# EAGLE design Plipbox (EAGLE 6.6.0)
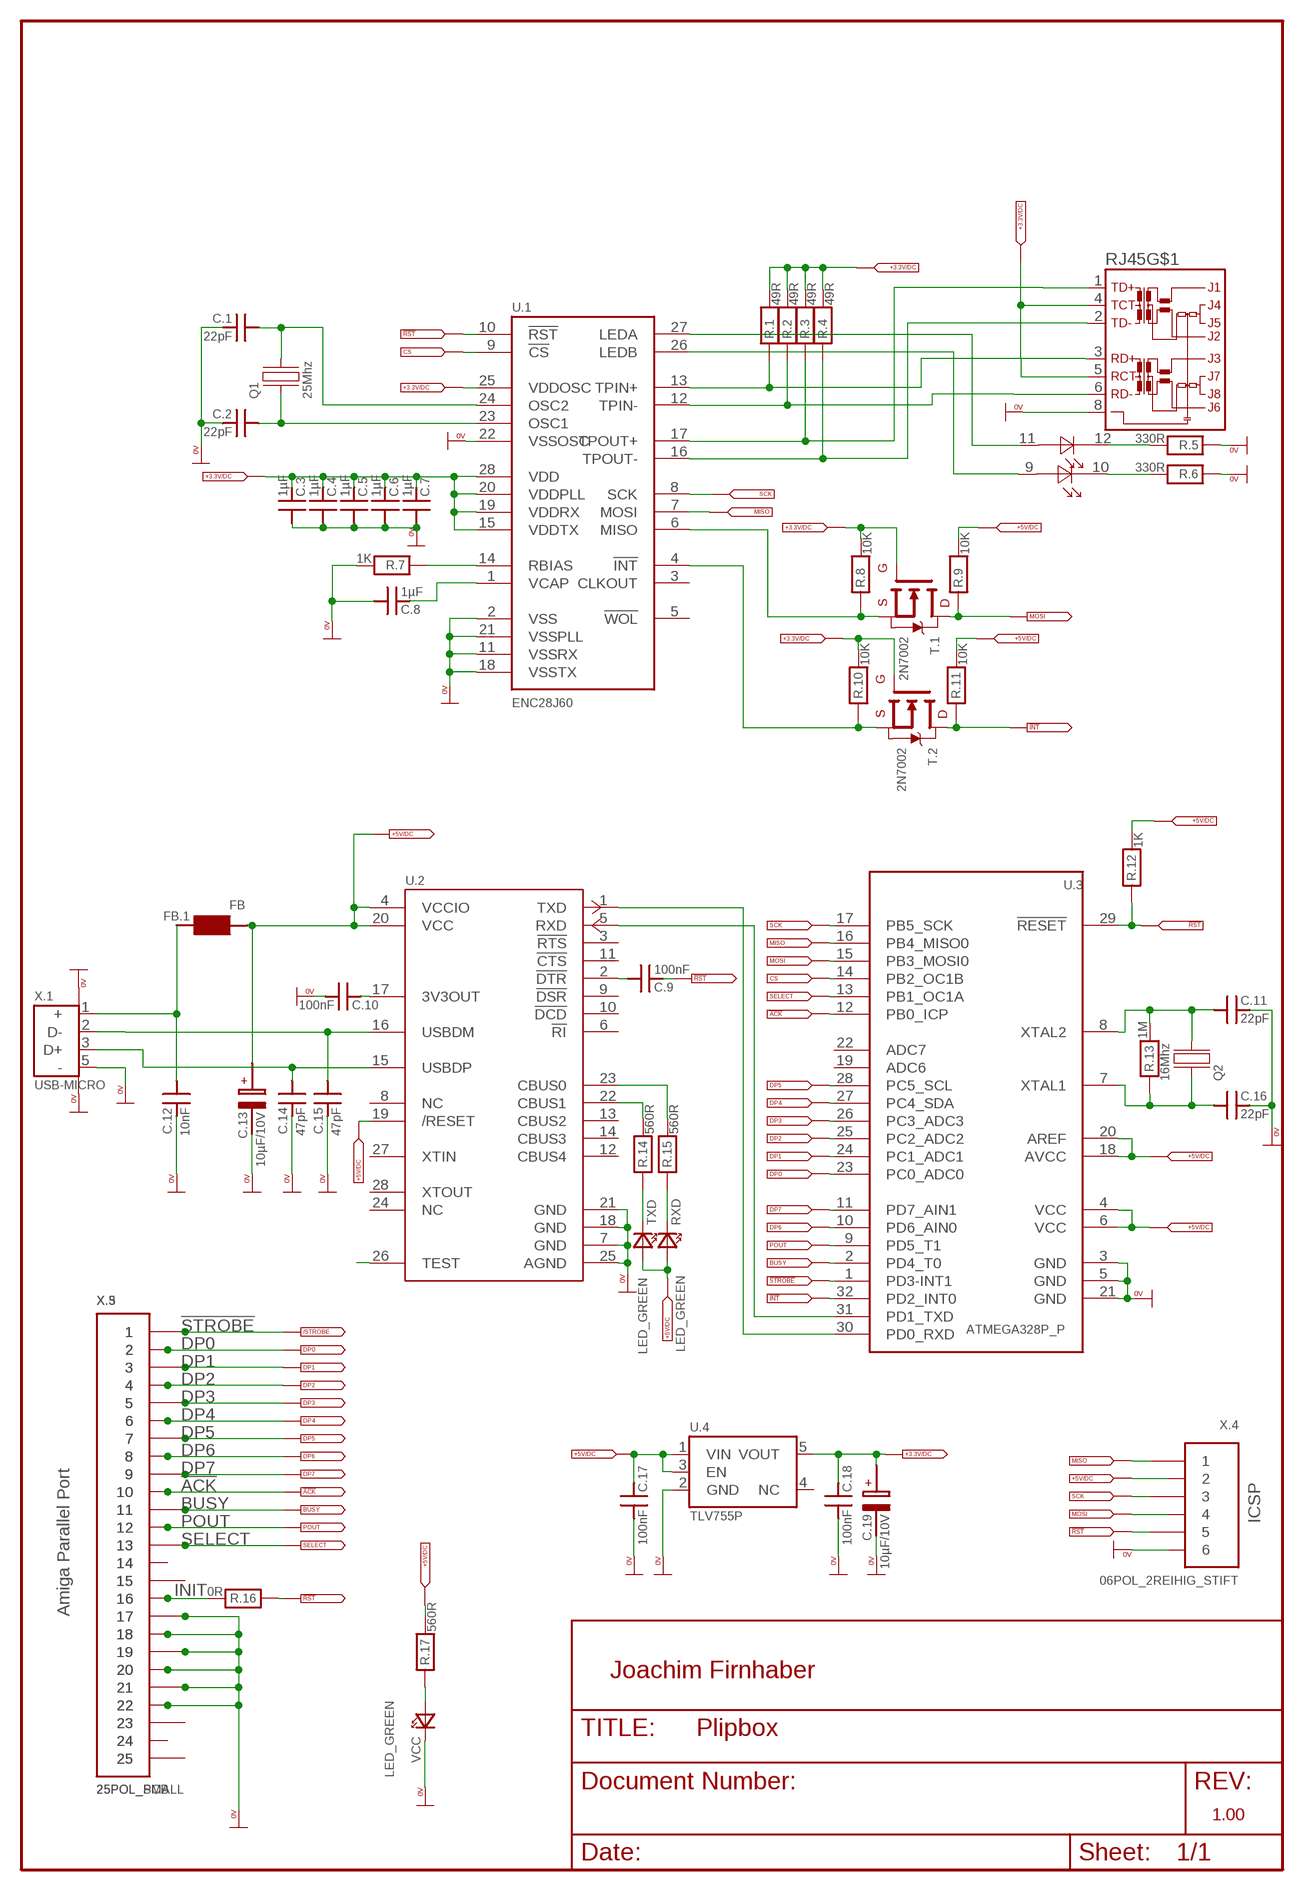
[diagram p0: schematic, sheet 1]

## Parts
C.1  22pF  CAPACITOR_SMD_0805  [0805]
C.2  22pF  CAPACITOR_SMD_0805  [0805]
C.3  1µF  CAPACITOR_SMD_0805  [0805]
C.4  1µF  CAPACITOR_SMD_0805  [0805]
C.5  1µF  CAPACITOR_SMD_0805  [0805]
C.6  1µF  CAPACITOR_SMD_0805  [0805]
C.7  1µF  CAPACITOR_SMD_0805  [0805]
C.8  1µF  CAPACITOR_SMD_0805  [0805]
C.9  100nF  CAPACITOR_SMD_0805  [0805]
C.10  100nF  CAPACITOR_SMD_0805  [0805]
C.11  22pF  CAPACITOR_SMD_0805  [0805]
C.12  10nF  CAPACITOR_SMD_0805  [0805]
C.13  10µF/10V  TANTAL_SMD_A(3216)  [3216]
C.14  47pF  CAPACITOR_SMD_0805  [0805]
C.15  47pF  CAPACITOR_SMD_0805  [0805]
C.16  22pF  CAPACITOR_SMD_0805  [0805]
C.17  100nF  CAPACITOR_SMD_0805  [0805]
C.18  100nF  CAPACITOR_SMD_0805  [0805]
C.19  10µF/10V  TANTAL_SMD_A(3216)  [3216]
FB.1  FB  FERRIT-BEAD  [0805]
Q1  25Mhz  QUARZ_3,4X2,7  [3,4X2,7X0,75]
Q2  16Mhz  QUARZ_3,4X2,7  [3,4X2,7X0,75]
R.1  49R  RESISTOR_SMD_0805  [0805]
R.2  49R  RESISTOR_SMD_0805  [0805]
R.3  49R  RESISTOR_SMD_0805  [0805]
R.4  49R  RESISTOR_SMD_0805  [0805]
R.5  330R  RESISTOR_SMD_0805  [0805]
R.6  330R  RESISTOR_SMD_0805  [0805]
R.7  1K  RESISTOR_SMD_0805  [0805]
R.8  10K  RESISTOR_SMD_0805  [0805]
R.9  10K  RESISTOR_SMD_0805  [0805]
R.10  10K  RESISTOR_SMD_0805  [0805]
R.11  10K  RESISTOR_SMD_0805  [0805]
R.12  1K  RESISTOR_SMD_0805  [0805]
R.13  1M  RESISTOR_SMD_0805  [0805]
R.14  560R  RESISTOR_SMD_0805  [0805]
R.15  560R  RESISTOR_SMD_0805  [0805]
R.16  0R  RESISTOR_SMD_0805  [0805]
R.17  560R  RESISTOR_SMD_0805  [0805]
RJ45  WE-RJ45_LAN_7499011222  [WE-RJ45_LAN_10/100_BASET_7499011222]
RXD  LED_GREEN  LED_0805  [0805]
T.1  2N7002  2N7002_N  [SOT23]
T.2  2N7002  2N7002_N  [SOT23]
TXD  LED_GREEN  LED_0805  [0805]
U.1  ENC28J60  EN28J60  [SSOP28]
U.2  FT232R_FT232RL  [SSOP28]
U.3  ATMEGA328P_P  [LQFP32]
U.4  TLV755P  [SOT23-5]
VCC  LED_GREEN  LED_0805  [0805]
X.1  USB-MICRO  [USB_MICRO]
X.3  25POL_SMALL  [SUB-D_25_M_ONLY]
X.4  06POL_2REIHIG_STIFT  [STIFT_2*03]
X.5  25POL_PCB  [SUB-D_25M_L]

## Nets
0V: C.1.2 C.2.2 C.3.1 C.4.1 C.5.1 C.6.1 C.7.1 C.8.1 C.10.1 C.11.2 C.12.2 C.13.- C.14.2 C.15.2 C.16.2 C.17.1 C.18.1 C.19.- R.5.1 R.6.1 R.7.2 RJ45.8 U.1.2(VSS) U.1.11(VSSRX) U.1.18(VSSTX) U.1.21(VSSPLL) U.1.22(VSSOSC) U.2.7(GND) U.2.18(GND) U.2.21(GND) U.2.25(AGND) U.3.3(GND) U.3.5(GND) U.3.21(GND) U.4.2(GND) VCC.K(KATHODE) X.1.5(-) X.1.6(GND) X.1.7(GND) X.3.17 X.3.18 X.3.19 X.3.20 X.3.21 X.3.22 X.4.6 X.5.17 X.5.18 X.5.19 X.5.20 X.5.21 X.5.22
!ACK: U.3.12(PB0_ICP) X.3.10 X.5.10
!INT: R.11.1 T.2.3(DRAIN) U.3.32(PD2_INT0)
!RST: C.9.2 R.12.1 R.16.1 U.1.10(!RST) U.3.29(!RESET) X.4.5
!STROBE: U.3.1(PD3-INT1) X.3.1 X.5.1 ; supply symbol labelled /STROBE
+3.3V: C.3.2 C.4.2 C.5.2 C.6.2 C.7.2 C.18.2 C.19.+ R.1.2 R.2.2 R.3.2 R.4.2 R.8.2 R.10.2 RJ45.4 RJ45.5 T.1.1(GATE) T.2.1(GATE) U.1.15(VDDTX) U.1.19(VDDRX) U.1.20(VDDPLL) U.1.25(VDDOSC) U.1.28(VDD) U.4.5(VOUT) ; supply symbol labelled +3.3V-OUT, +3.3V-IN
+5V: C.13.+ C.17.2 FB.1.1 R.9.2 R.11.2 R.12.2 R.17.2 RXD.A(ANODE) TXD.A(ANODE) U.2.4(VCCIO) U.2.19(/RESET) U.2.20(VCC) U.3.4(VCC) U.3.6(VCC) U.3.18(AVCC) U.3.20(AREF) U.4.1(VIN) U.4.3(EN) X.4.2 ; supply symbol labelled +5V-IN, +5V-OUT
/RXLED: R.14.2 U.2.22(CBUS1)
/TXLED: R.15.2 U.2.23(CBUS0)
BUSY: U.3.2(PD4_T0) X.3.11 X.5.11
CS: U.1.9(!CS) U.3.14(PB2_OC1B)
DP0: U.3.23(PC0_ADC0) X.3.2 X.5.2
DP1: U.3.24(PC1_ADC1) X.3.3 X.5.3
DP2: U.3.25(PC2_ADC2) X.3.4 X.5.4
DP3: U.3.26(PC3_ADC3) X.3.5 X.5.5
DP4: U.3.27(PC4_SDA) X.3.6 X.5.6
DP5: U.3.28(PC5_SCL) X.3.7 X.5.7
DP6: U.3.10(PD6_AIN0) X.3.8 X.5.8
DP7: U.3.11(PD7_AIN1) X.3.9 X.5.9
INIT: R.16.2 X.3.16 X.5.16
MISO: U.1.7(MOSI) U.3.16(PB4_MISO0) X.4.1
MOSI: R.9.1 T.1.3(DRAIN) U.3.15(PB3_MOSI0) X.4.4
N$1: C.16.1 Q2.2(XTAL1) R.13.1 U.3.7(XTAL1)
N$2: R.4.1 RJ45.2 U.1.16(TPOUT-)
N$3: C.9.1 U.2.2(!DTR)
N$4: R.1.1 RJ45.3 U.1.13(TPIN+)
N$5: C.11.1 Q2.4(XTAL2) R.13.2 U.3.8(XTAL2)
N$6: R.2.1 RJ45.6 U.1.12(TPIN-)
N$7: R.3.1 RJ45.1 U.1.17(TPOUT+)
N$8: C.8.2 U.1.1(VCAP)
N$9: R.7.1 U.1.14(RBIAS)
N$10: R.8.1 T.1.2(SOURCE) U.1.6(MISO)
N$11: X.3.14 X.5.14
N$12: C.2.1 Q1.2(XTAL1) U.1.23(OSC1)
N$13: C.1.1 Q1.4(XTAL2) U.1.24(OSC2)
N$14: R.10.1 T.2.2(SOURCE) U.1.4(!INT)
N$15: X.3.15 X.5.15
N$16: U.2.26(TEST)
N$17: X.3.23 X.5.23
N$18: X.3.24 X.5.24
N$19: X.3.25 X.5.25
N$24: RJ45.11(A) U.1.27(LEDA)
N$25: RJ45.9(A) U.1.26(LEDB)
N$26: R.6.2 RJ45.10(K)
N$27: R.5.2 RJ45.12(K)
N$28: C.10.2 U.2.17(3V3OUT)
N$29: R.15.1 RXD.K(KATHODE)
N$30: R.14.1 TXD.K(KATHODE)
N$31: U.2.1(TXD) U.3.30(PD0_RXD)
N$32: R.17.1 VCC.A(ANODE)
N$103: C.12.1 FB.1.2 X.1.1(+)
POUT: U.3.9(PD5_T1) X.3.12 X.5.12
SCK: U.1.8(SCK) U.3.17(PB5_SCK) X.4.3
SELECT: U.3.13(PB1_OC1A) X.3.13 X.5.13
TXD1: U.2.5(RXD) U.3.31(PD1_TXD)
USB+: C.14.1 U.2.15(USBDP) X.1.3(D+)
USB-: C.15.1 U.2.16(USBDM) X.1.2(D-)
Unconnected: U.1.3(CLKOUT) U.1.5(!WOL) U.2.3(!RTS) U.2.6(!RI) U.2.8(NC) U.2.9(!DSR) U.2.10(!DCD) U.2.11(!CTS) U.2.12(CBUS4) U.2.13(CBUS2) U.2.14(CBUS3) U.2.24(NC) U.2.27(XTIN) U.2.28(XTOUT) U.3.19(ADC6) U.3.22(ADC7) U.4.4(NC)

## Notes on the sheet
- ICSP
- Amiga Parallel Port
- Joachim Firnhaber
- 1.00

## Library data of the parts
C.1-C.12 C.14-C.18 = de_discrete:CAPACITOR
C.13 C.19 = de_discrete:TANTAL*
FB.1 = de_discrete:FERRIT-BEAD
Q1 Q2 = de_crystal:QUARZ
R.1-R.17 = de_discrete:RESISTOR
RJ45 = de_lan:WE-RJ45_LAN_7499011222: WE-RJ45 LAN Transformer 10/100 BaseT with LED - RJ45 connector with integrated transformer common mode choke - 350 µH min.OCL with 8 mA bias - Complies with IEEE 802.3 - Extended temperature range from -40°C to +85°C available -- ADSL Modem -- Embedded PC -- LAN network applications -- Hub, Router, Switches
RXD TXD VCC = de_light:LED
T.1 T.2 = de_transistor:2N7002
U.1 = de_ic:EN28J60
U.2 = de_ic:FT232R
U.3 = de_controller:ATMEGA328P
U.4 = de_power:TLV755P
X.1 = de_connectors:USB-MICRO; FCI: 10104110-0001LF
X.3 X.5 = de_connectors:25POL
X.4 = de_connectors:06POL

## Board
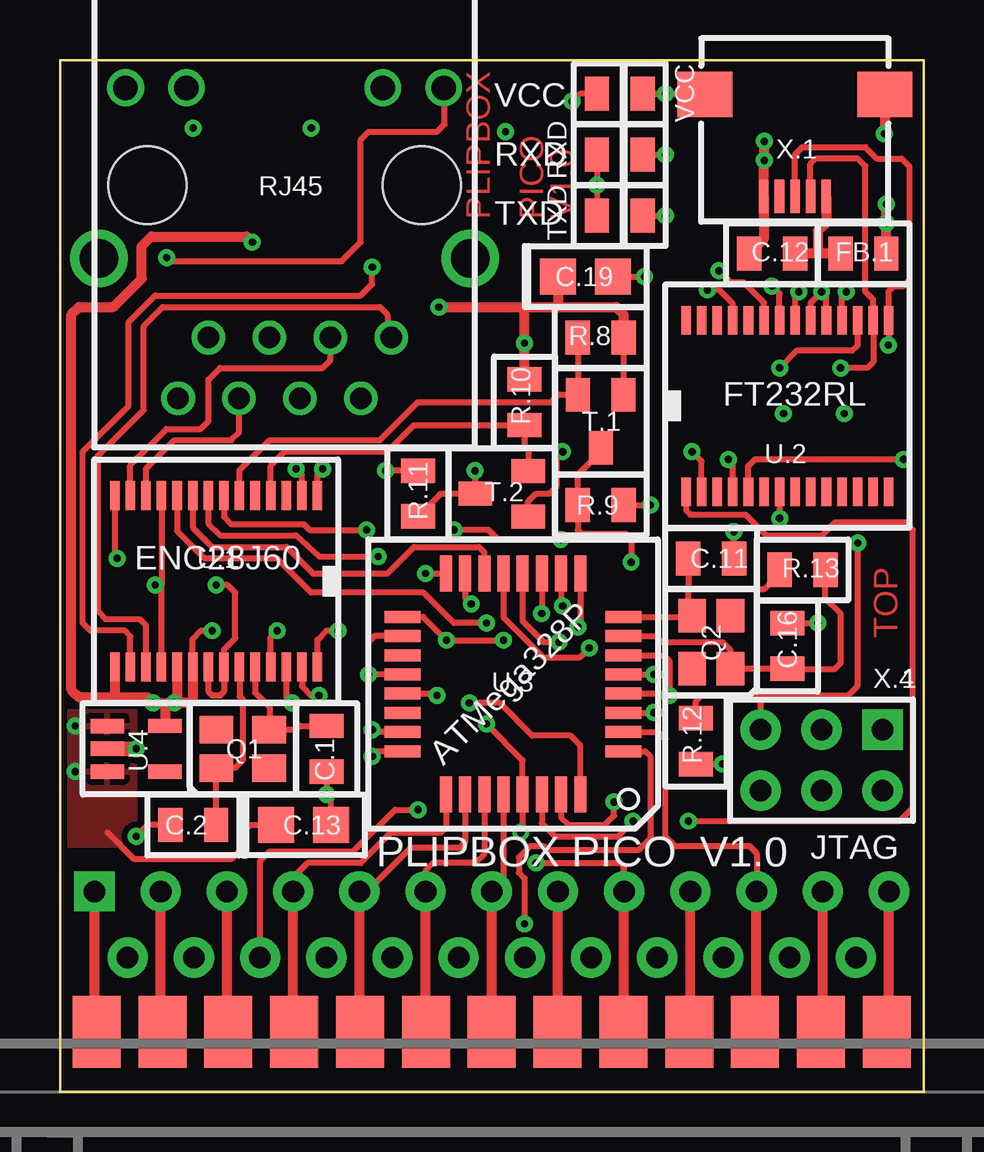
[diagram p1: board, top side]
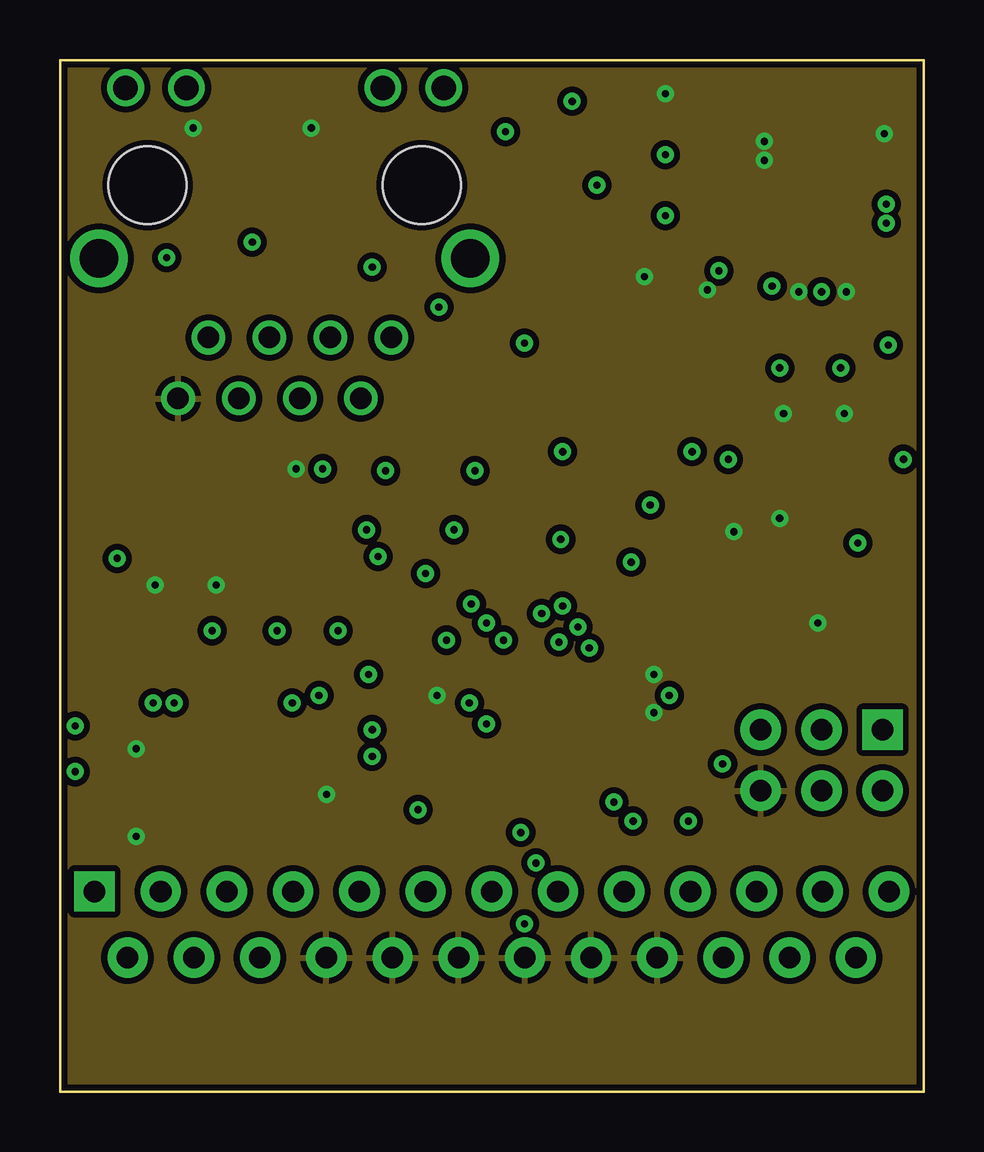
[diagram p2: board, inner layer 0V]
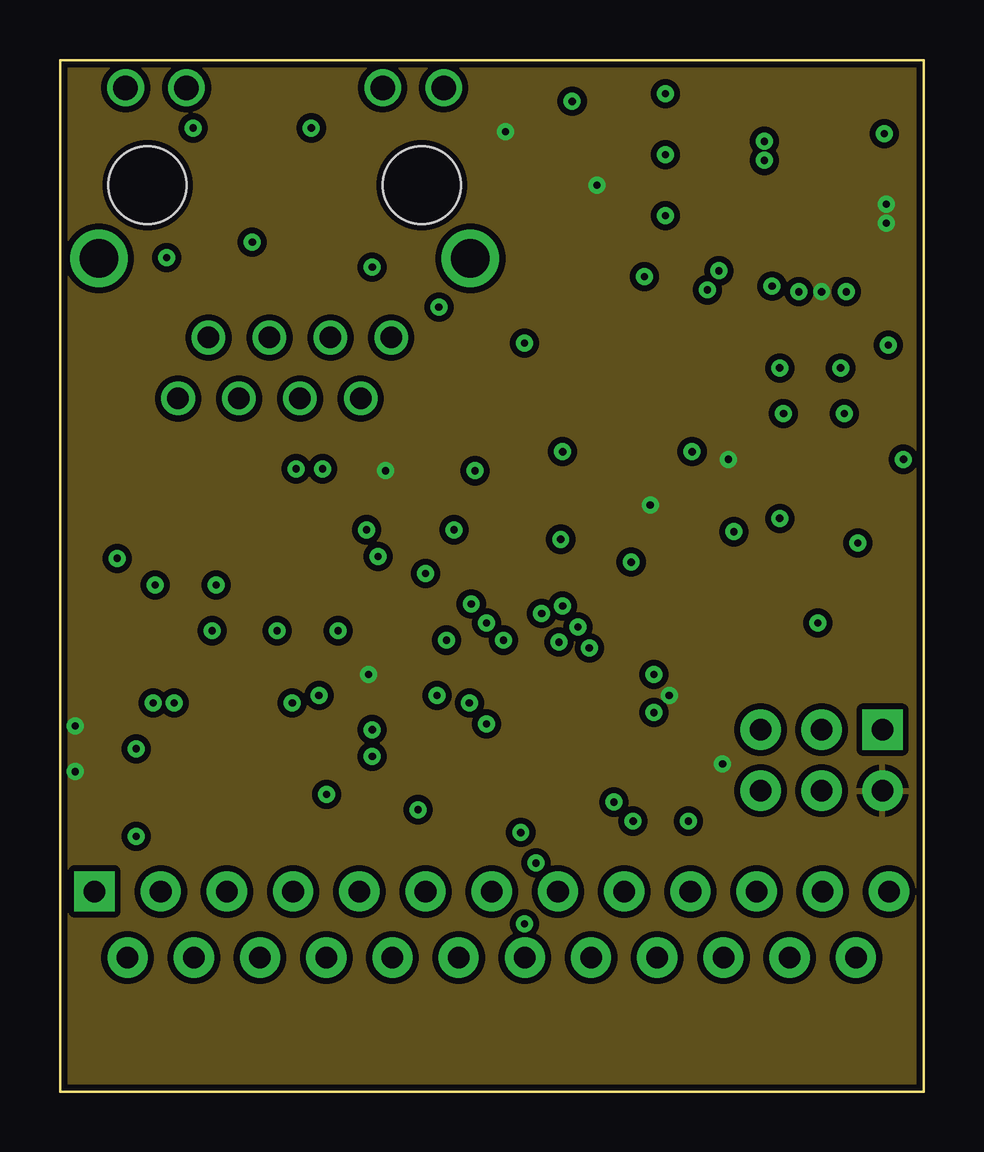
[diagram p3: board, inner layer +5V]
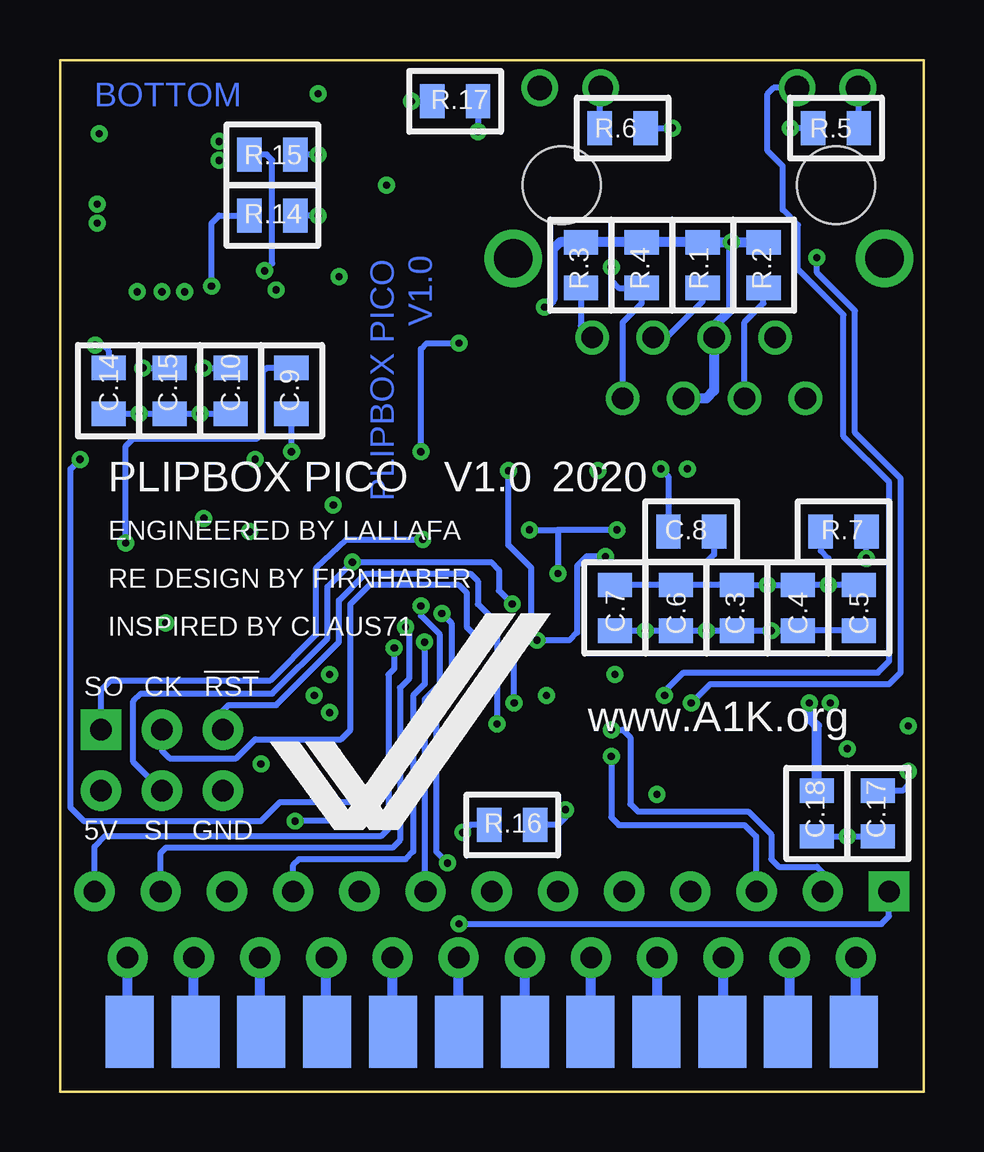
[diagram p4: board, bottom side, seen from below]

Size 36 x 43 mm. Coordinates in mm from the lower left corner, seen from the top.
Outline: 0,0 36,0 36,43 0,43 0,0
Copper layers (1*2*3*16): Top 0.035mm / dielectric 1.5mm / 0V 0.035mm / dielectric 0.15mm / +5V 0.035mm / dielectric 0.2mm / Bottom 0.035mm
Design rules "default *": minimum track width 10mil, minimum drill 24mil, track to track 5mil, track to pad 5mil, pad to pad 5mil, via to via 5mil, smd to smd 5mil, copper to edge 10mil, drill to drill 8mil, minimum pad ring 10mil, minimum via ring 8mil, stop-mask expansion 4mil, vias tented up to drill 20mil, thermal gap 10mil

### Footprints (pad centres in the part's own frame; a part is rotated, then mirrored left to right if it is on the bottom)
0805 = smd 1.016 x 1.422: 1 -0.953,0; 2 0.953,0
3216 = smd 1.5 x 1.5: + -1.15,0; - 1.15,0
3,4X2,7X0,75 = smd 1.4 x 1.15: 1 -1.1,0.8; 2 -1.1,-0.8; 3 1.1,-0.8; 4 1.1,0.8
WE-RJ45_LAN_10/100_BASET_7499011222 = drill 0.9: 1 4.445,-6.35; 2 3.175,-8.89; 3 1.905,-6.35; 4 0.635,-8.89; 5 -0.635,-6.35; 6 -1.905,-8.89; 7 -3.175,-6.35; 8 -4.445,-8.89 | drill 1.02: 9 6.63,4.06; 10 4.09,4.06; 11 -4.09,4.06; 12 -6.63,4.06 | drill 1.6: Z1 -7.745,-3.05; Z2 7.745,-3.05 | hole 3.25: 5.715,0; -5.715,0
0805' = smd 1.016 x 1.422: A -0.953,0; K 0.953,0
SOT23 = smd 1 x 1.4: 1 -0.95,-1.1; 2 0.95,-1.1; 3 0,1.1
SSOP28 = smd 0.4 x 1.2: 1 -4.225,-3.575; 2 -3.575,-3.575; 3 -2.925,-3.575; 4 -2.275,-3.575; 5 -1.625,-3.575; 6 -0.975,-3.575; 7 -0.325,-3.575; 8 0.325,-3.575; 9 0.975,-3.575; 10 1.625,-3.575; 11 2.275,-3.575; 12 2.925,-3.575; 13 3.575,-3.575; 14 4.225,-3.575; 15 4.225,3.575; 16 3.575,3.575; 17 2.925,3.575; 18 2.275,3.575; 19 1.625,3.575; 20 0.975,3.575; 21 0.325,3.575; 22 -0.325,3.575; 23 -0.975,3.575; 24 -1.625,3.575; 25 -2.275,3.575; 26 -2.925,3.575; 27 -3.575,3.575; 28 -4.225,3.575
LQFP32 = smd 1.5 x 0.5: 1 -4.6,2.8; 2 -4.6,2; 3 -4.6,1.2; 4 -4.6,0.4; 5 -4.6,-0.4; 6 -4.6,-1.2; 7 -4.6,-2; 8 -4.6,-2.8; 17 4.6,-2.8; 18 4.6,-2; 19 4.6,-1.2; 20 4.6,-0.4; 21 4.6,0.4; 22 4.6,1.2; 23 4.6,2; 24 4.6,2.8 | smd 0.5 x 1.5: 9 -2.8,-4.6; 10 -2,-4.6; 11 -1.2,-4.6; 12 -0.4,-4.6; 13 0.4,-4.6; 14 1.2,-4.6; 15 2,-4.6; 16 2.8,-4.6; 25 2.8,4.6; 26 2,4.6; 27 1.2,4.6; 28 0.4,4.6; 29 -0.4,4.6; 30 -1.2,4.6; 31 -2,4.6; 32 -2.8,4.6
SOT23-5 = smd 0.6 x 1.4: 1 -0.95,-1.2; 2 -0.003,-1.2; 3 0.95,-1.2; 4 0.953,1.2; 5 -0.953,1.2
USB_MICRO = smd 0.4 x 1.4: 1 -1.3,0; 2 -0.65,0; 3 0,0; 4 0.65,0; 5 1.3,0 | smd 2.3 x 1.9: 6 -3.75,-4.25; 7 3.75,-4.25
SUB-D_25_M_ONLY = drill 0.9 pad 1.676 square: 1 -16.56,13.84 | drill 0.9 pad 1.676: 2 -13.8,13.84; 3 -11.04,13.84; 4 -8.28,13.84; 5 -5.52,13.84; 6 -2.76,13.84; 7 0,13.84; 8 2.76,13.84; 9 5.52,13.84; 10 8.28,13.84; 11 11.04,13.84; 12 13.8,13.84; 13 16.56,13.84; 14 -15.18,11.08; 15 -12.42,11.08; 16 -9.66,11.08; 17 -6.9,11.08; 18 -4.14,11.08; 19 -1.38,11.08; 20 1.38,11.08; 21 4.14,11.08; 22 6.9,11.08; 23 9.66,11.08; 24 12.42,11.08; 25 15.18,11.08
STIFT_2*03 = drill 0.9 pad 1.676 square: 1 -1.27,2.54 | drill 0.9 pad 1.676: 2 1.27,2.54; 3 -1.27,0; 4 1.27,0; 5 -1.27,-2.54; 6 1.27,-2.54
SUB-D_25M_L = smd 2 x 3: 1 -16.466,0.5; 2 -13.723,0.5; 3 -10.98,0.5; 4 -8.237,0.5; 5 -5.494,0.5; 6 -2.749,0.5; 7 -0.004,0.5; 8 2.741,0.5; 9 5.486,0.5; 10 8.231,0.5; 11 10.976,0.5; 12 13.721,0.5; 13 16.466,0.5 | smd 2 x 3 bottom: 14 -15.095,0.5; 15 -12.352,0.5; 16 -9.608,0.5; 17 -6.865,0.5; 18 -4.12,0.5; 19 -1.375,0.5; 20 1.37,0.5; 21 4.115,0.5; 22 6.86,0.5; 23 9.605,0.5; 24 12.35,0.5; 25 15.095,0.5

### Placement (x,y rotation side)
C.1  11.11,14.29 270 top
C.2  5.56,11.11 180 top
C.3  7.78,20.16 270 bottom
C.4  5.24,20.16 270 bottom
C.5  2.7,20.16 270 bottom
C.6  10.32,20.16 270 bottom
C.7  12.86,20.16 270 bottom
C.8  9.68,23.34 180 bottom
C.9  26.35,29.21 90 bottom
C.10  28.89,29.21 90 bottom
C.11  27.15,22.23 0 top
C.12  29.69,34.92 180 top
C.13  10.16,11.11 0 top
C.14  33.97,29.21 270 bottom
C.15  31.43,29.21 270 bottom
C.16  30.32,18.57 90 top
C.17  1.91,11.59 90 bottom
C.18  4.45,11.59 90 bottom
C.19  21.91,33.97 0 top
FB.1  33.5,34.92 180 top
Q1  7.62,14.29 0 top
Q2  27.15,18.73 90 top
R.1  9.21,34.45 90 bottom
R.2  6.67,34.45 90 bottom
R.3  14.29,34.45 90 bottom
R.4  11.75,34.45 90 bottom
R.5  3.65,40.16 0 bottom
R.6  12.54,40.16 180 bottom
R.7  3.33,23.34 180 bottom
R.8  22.54,31.43 0 top
R.9  22.54,24.45 0 top
R.10  19.37,28.73 90 top
R.11  14.92,24.92 90 top
R.12  26.51,14.61 270 top
R.13  30.96,21.75 180 top
R.14  27.15,36.51 180 bottom
R.15  27.15,39.05 180 bottom
R.16  17.14,11.11 0 bottom
R.17  19.53,41.27 0 bottom
RJ45  9.37,37.78 0 top
RXD  LED_GREEN  [0805']  23.34,39.05 0 top
T.1  22.54,27.94 180 top
T.2  18.41,24.92 90 top
TXD  LED_GREEN  [0805']  23.34,36.51 0 top
U.1  6.51,21.27 180 top
U.2  30.32,28.57 0 top
U.3  18.89,16.99 180 top
U.4  3.17,14.29 270 top
VCC  LED_GREEN  [0805']  23.34,41.59 0 top
X.1  30.64,37.31 180 top
X.3  18,-5.5 0 top
X.4  31.75,13.81 270 top
X.5  18,2 0 top

### Tracks (layer width: path | path; a pad name or v marks a point on that pad's centre or on a via)
0V  (via drill 0.3)
  Top 0.254: C.13.- 11.31,12.19 v11.11,12.38 C.1.2 | C.2.2 3.65,11.11 v3.17,10.64 | v3.17,14.29 | U.1.18 4.23,21.06 | 4.23,21.06 4.23,21.09 | 4.23,21.09 v3.97,21.11 4.23,21.06 | v6.51,21.11 6.99,21.11 7.3,20.8 7.3,18.89 6.83,18.42 U.1.22 6.83,16.68 6.67,16.51 6.35,16.51 6.18,16.68 U.1.21 | U.1.11 4.23,21.09 | U.3.21 15.64,16.59 v15.72,16.51 | C.11.2 v28.1,23.34 | U.2.7 30,24.04 v30,23.89 | C.16.2 v31.59,19.53 | U.1.2 10.08,25.72 v9.84,25.96 | VCC.K v25.24,41.59 26.85,41.59 X.1.7 | U.2.18 32.6,33.15 v32.78,33.34 | U.2.21 30.65,33.19 v30.8,33.34 | C.19.- v24.37,33.97 | U.3.3 24.84,15.79 v24.77,15.8 | U.3.5 24.84,17.39 v24.77,17.38 | U.2.25 28.05,32.83 27.46,33.42 v26.99,33.42
  Top 0.406: C.12.2 29.34,35.53 X.1.5 29.34,38.78 v29.37,38.81 v29.37,39.61 | X.1.6 34.39,39.95 v34.37,39.93
  Top 0.61: U.4.2 v3.17,14.29
  Bottom 0.254: C.17.1 v3.17,10.64 C.18.1 | v3.97,21.11 C.4.1 v6.51,21.11 C.3.1 9.05,21.11 | C.5.1 v3.97,21.11 | R.7.2 4.29,22.54 3.97,22.23 v3.97,21.11 | 9.05,21.11 C.6.1 C.7.1 | C.8.1 8.73,22.38 9.05,22.07 9.05,21.11 | R.6.1 v10.48,40.16 | R.5.1 v5.56,40.16 | C.14.2 v32.7,28.26 C.15.2 v30.16,28.26 C.10.1
  Bottom 0.406: X.5.17 11.1,2.04 X.3.17 | X.5.18 13.86,2.02 X.3.18 | X.5.19 16.62,2 X.3.19 | X.5.20 19.38,2.01 X.3.20 | X.5.21 22.14,2.02 X.3.21 | X.5.22 24.9,2.04 X.3.22
  pour 0V (isolate 0.254): 0,0 0,43 36,43 36,0
!ACK  (via drill 0.3)
  Top 0.254: U.3.12 19.29,20.4 19.29,19.61 20.16,18.73 v20.8,18.73
  Top 0.406: X.5.10 26.28,2.05 X.3.10
  Bottom 0.254: v20.8,18.73 20.8,16.99 21.27,16.51 21.27,10 21.59,9.68 26.04,9.68 26.28,9.44 X.3.10
!INT  (via drill 0.3)
  Top 0.254: U.3.32 21.69,14.42 21.27,14.84 19.68,14.84 18.34,16.19 v17.07,16.19 | R.11.1 15.86,24.91 T.2.3 17.3,24.93 v17.3,25.88
  Bottom 0.254: v17.07,16.19 17.07,19.13 16.35,19.84 16.35,21.83 17.3,22.78 v17.3,25.88
!RST  (via drill 0.3)
  Top 0.254: v19.21,10.79 19.29,10.87 U.3.29 19.29,13.81 v17.78,15.32 | U.1.10 4.88,23.37 6.03,22.23 9.05,22.23 10.48,20.8 15.16,20.8 16.43,19.53 v17.78,19.53 | 29.21,16.51 32.86,16.51 33.26,16.91 v33.26,22.86 | R.12.1 26.51,16.27 26.75,16.51 29.21,16.51 | X.4.5 29.21,16.51
  Bottom 0.254: R.16.1 18.89,11.11 v19.21,10.79 | C.9.2 27.38,30.16 27.54,30 27.54,27.46 27.78,27.23 32.94,27.23 33.26,26.91 v33.26,22.86 | X.4.5 29.21,15.88 28.97,16.11 26.99,16.11 24.37,18.73 24.37,20.48 23.26,21.59 18.89,21.59 18.57,21.27 18.57,20.32 v17.78,19.53 v17.78,15.32
!STROBE  (via drill 0.3)
  Top 0.254: v19.37,6.99 19.37,8.89 19.13,9.13 19.13,9.76 19.61,10.24 20.16,10.24 20.32,10.08 24.13,10.08 24.61,10.56 24.61,13.97 24.39,14.19 U.3.1
  Top 0.406: X.5.1 1.44,2.09 X.3.1
  Bottom 0.254: X.3.1 1.44,7.3 1.76,6.99 v19.37,6.99
+3.3V  (via drill 0.3)
  Top 0.254: 4.88,16.31 v4.76,16.19 | U.1.20 5.53,18.87 5.87,19.21 v6.35,19.21 | U.1.25 8.78,18.94 v9.05,19.21 | U.1.28 10.73,18.83 11.11,19.21 v11.59,19.21 | R.8.2 T.1.1 | 2.27,16.43 2.28,16.45 | T.2.1 19.52,24.59 19.84,24.92 20.4,24.92 20.72,25.24 20.72,26.43 v20.95,26.67
  Top 0.406: U.1.19 4.88,16.31 | U.1.20 5.53,16.33 5.4,16.19 v4.76,16.19 v3.89,16.19 | U.1.15 2.28,16.45 | v15.8,32.7 19.37,32.7 | 19.37,32.7 20.8,32.7 | v3.89,16.19 4.38,16.19 U.4.5 | v3.89,16.19 3.65,16.43 2.27,16.43 0.79,16.43 0.48,16.75 0.48,32.38 0.79,32.7 2.22,32.7 3.41,33.89 3.41,35.24 3.81,35.64 7.78,35.64 v8.02,35.4 | C.19.+ 20.76,32.74 20.8,32.7 | 20.8,32.7 23.18,32.7 23.5,32.38 R.8.2 | R.10.2 v19.37,31.19 19.37,32.7
  Bottom 0.254: C.7.2 v11.59,19.21 C.6.2 v9.05,19.21 C.3.2 v6.35,19.21 C.4.2 C.5.2 | v20.95,26.67 20.95,30.96 20.72,31.19 v19.37,31.19
  Bottom 0.406: C.18.2 4.45,15.24 4.76,15.56 v4.76,16.19 | v8.02,35.4 R.1.2 R.4.2 R.3.2 15.16,35.4 15.48,35.08 15.48,33.02 v15.8,32.7 | v8.02,35.4 R.2.2 | RJ45.4 9.05,28.89 8.73,29.21 RJ45.5 8.73,31.91 8.02,32.62 v8.02,35.4
+5V  (via drill 0.3)
  Top 0.254: C.13.+ 7.94,11.11 7.62,10.79 7.62,10.16 7.14,9.68 3.1,9.68 1.98,10.79 | U.3.18 13.11,18.99 12.86,18.73 v12.86,17.38 v12.86,17.39 U.3.20 | RXD.A v22.38,37.78 TXD.A | U.2.19 31.95,33.14 v31.75,33.34 31.3,32.88 U.2.20 | R.11.2 v13.57,25.88 | R.9.2 v24.61,24.45 | U.2.4 28.05,26.17 v27.86,26.35 | U.3.6 25.15,18.19 25.4,17.94 25.4,16.59 | U.3.4 25.4,16.59 | v25.4,16.51 25.4,16.59 | R.12.2 v27.62,13.65
  Top 0.406: v34.45,36.99 FB.1.1 v34.45,36.2
  Bottom 0.254: v0.64,13.34 0.64,12.78 0.87,12.54 C.17.2 | R.17.2 v18.57,40.01
  other vias: 0.64,15.24
  pour +5V (isolate 0.254): 0,0 0,43 36,43 36,0
  pour Top (isolate 0.254): 0.24,10.24 3.17,10.24 3.17,15.88 0.24,15.88
/RXLED  (via drill 0.3)
  Top 0.254: U.2.22 30,33.27 v29.69,33.58
  Bottom 0.254: v29.69,33.58 29.69,36.2 29.37,36.51 R.14.2
/TXLED  (via drill 0.3)
  Top 0.254: U.2.23 29.35,32.88 28.5,33.73 27.94,33.73 v27.46,34.21
  Bottom 0.254: v27.46,34.21 27.15,34.53 27.15,38.81 27.38,39.05 R.15.2
BUSY
  Top 0.254: X.3.11 29.05,8.35 29.05,9.92 28.73,10.24 25.64,10.24 25.24,10.64 25.24,14.68 24.94,14.99 U.3.2
  Top 0.406: X.5.11 29.04,2.06 X.3.11
CS
  Top 0.254: U.1.9 5.53,23.52 6.35,22.7 9.45,22.7 10.56,21.59 13.65,21.59 14.76,22.7 17.46,22.7 17.69,22.47 U.3.14
DP0  (via drill 0.3)
  Top 0.254: U.3.23 13.11,14.99 v13.02,15.08
  Top 0.406: X.5.2 4.2,2.08 X.3.2
  Bottom 0.254: v13.02,15.08 12.54,15.08 12.22,14.76 12.22,11.99 11.91,11.67 7.3,11.67 6.35,10.72 6.35,9.68 6.03,9.37 4.45,9.37 4.13,9.05 4.13,8.41 X.3.2
DP1  (via drill 0.3)
  Top 0.254: U.3.24 13.23,14.19 v13.02,13.97
  Top 0.406: X.5.3 6.96,2.06 X.3.3
  Bottom 0.254: v13.02,13.97 13.02,11.43 12.7,11.11 7.46,11.11 6.99,10.64 6.99,8.37 X.3.3
DP2
  Top 0.254: U.3.25 16.09,11.01 15.88,10.79 13.81,10.79 12.54,9.53 10.32,9.53 9.68,8.89 9.68,8.38 X.3.4
  Top 0.406: X.5.4 9.72,2.04 X.3.4
DP3
  Top 0.254: U.3.26 16.89,10.38 16.67,10.16 14.61,10.16 12.86,8.41 12.54,8.41 12.54,8.4 X.3.5
  Top 0.406: X.5.5 12.48,2.03 X.3.5
DP4
  Top 0.254: U.3.27 17.69,9.91 17.3,9.53 15.56,9.53 15.24,9.21 X.3.6
  Top 0.406: X.5.6 15.24,2.01 X.3.6
DP5
  Top 0.254: U.3.28 18.49,8.83 X.3.7
  Top 0.406: X.5.7 18,2 X.3.7
DP6  (via drill 0.3 pad 0.15)
  Top 0.254: U.3.10 20.89,20.3 v20.95,20.24
  Top 0.406: X.5.8 20.76,2.02 X.3.8
  Bottom 0.254: X.3.8 20.8,8.38 20.8,16.35 20.16,16.99 20.16,19.05 20.95,19.84 v20.95,20.24
DP7  (via drill 0.3, 0.3 pad 0.15)
  Top 0.254: v19.84,9.53 23.34,9.53 23.52,9.34 X.3.9 | U.3.11 20.09,19.93 v20.08,19.92
  Top 0.406: X.5.9 23.52,2.03 X.3.9
  Bottom 0.254: v19.84,9.53 20.32,10 20.32,16.19 19.68,16.83 19.68,19.53 v20.08,19.92
INIT  (via drill 0.3)
  Top 0.254: X.3.16 8.34,9.61 8.73,10 12.22,10 13.97,11.75 v14.92,11.75
  Bottom 0.254: v14.92,11.75 14.92,11.43 15.24,11.11 R.16.2
  Bottom 0.406: X.5.16 8.34,2.05 X.3.16
MISO  (via drill 0.3)
  Top 0.254: U.1.7 6.83,23.96 7.14,23.65 10.16,23.65 10.4,23.42 v12.78,23.42 | v15.24,21.59 U.3.16 | v20.88,23.02 18.26,23.02 17.86,23.42 v16.43,23.42
  Bottom 0.254: X.4.1 34.29,16.75 33.89,17.14 27.23,17.14 25.32,19.05 25.32,21.83 24.05,23.02 v20.88,23.02 | v12.78,23.42 15.24,23.42 | 15.24,23.42 v15.24,21.59 | v16.43,23.42 15.24,23.42
MOSI  (via drill 0.3)
  Top 0.254: U.3.15 16.89,20.57 v17.14,20.32 | T.1.3 22.54,26.67 21.59,25.72 R.9.1 21.59,23.42 21.75,23.26 23.57,23.26 23.81,23.02 v23.81,22.07
  Bottom 0.254: X.4.4 32.94,13.73 32.94,16.27 32.62,16.59 27.15,16.59 24.84,18.89 24.84,21.03 v23.81,22.07 18.02,22.07 17.7,21.75 17.7,20.88 v17.14,20.32
N$1
  Top 0.254: R.13.1 31.91,20.56 32.54,19.92 32.54,17.86 32.31,17.62 C.16.1 Q2.2 27.94,18.41 27.62,18.73 25.08,18.73 24.83,18.99 U.3.7
N$2  (via drill 0.3)
  Top 0.254: U.1.16 2.93,18.97 2.7,19.21 1.27,19.21 0.95,19.53 0.95,26.67 2.86,28.57 2.86,32.07 3.97,33.18 12.54,33.18 13.02,33.66 v13.02,34.37
  Bottom 0.254: RJ45.2 12.54,32.07 11.75,32.86 R.4.1 12.7,33.5 13.02,33.81 v13.02,34.37
N$3  (via drill 0.3)
  Top 0.254: U.2.2 26.75,26.28 v26.35,26.67
  Bottom 0.254: v26.35,26.67 C.9.1
N$4
  Top 0.254: U.1.13 2.93,26.11 4.45,27.62 5.87,27.62 6.19,27.94 6.19,29.69 6.67,30.16 10.95,30.16 11.27,30.48 RJ45.3
  Bottom 0.254: RJ45.3 10.72,31.43 9.21,32.94 R.1.1
N$5
  Top 0.254: 26.19,20.95 26.19,20.32 26.35,20.17 Q2.4 26.3,19.79 U.3.8 | C.11.1 26.19,20.95 | 26.19,20.95 29.37,20.95 29.69,21.27 29.69,21.43 R.13.2
N$6
  Top 0.254: U.1.12 3.58,25.97 4.76,27.15 7.14,27.15 7.46,27.46 RJ45.6
  Bottom 0.254: RJ45.6 7.46,32.07 6.67,32.86 R.2.1
N$7
  Top 0.254: U.1.17 3.58,19.43 3.33,19.68 1.91,19.68 1.59,20 1.59,26.51 3.49,28.42 3.49,31.91 4.29,32.7 13.34,32.7 13.65,32.38 13.65,31.59 RJ45.1
  Bottom 0.254: R.3.1 14.29,31.91 RJ45.1
N$8  (via drill 0.3)
  Top 0.254: U.1.1 10.73,25.74 v10.95,25.96
  Bottom 0.254: v10.95,25.96 10.64,25.64 C.8.2
N$9  (via drill 0.3)
  Top 0.254: U.1.14 2.28,22.32 v2.38,22.23
  Bottom 0.254: v2.38,22.23 R.7.1
N$10
  Top 0.254: U.1.6 7.48,25.9 8.73,27.15 13.34,27.15 14.92,28.73 20.48,28.73 20.8,29.05 T.1.2 R.8.1
N$11
  Bottom 0.406: X.5.14 2.82,2.08 X.3.14
N$12
  Top 0.254: C.2.1 6.51,13.48 Q1.2 7.3,13.49 7.62,13.81 7.62,16.35 7.48,16.49 U.1.23
N$13
  Top 0.254: U.1.24 8.13,16.63 8.73,16.03 Q1.4 9.85,15.09 10,15.24 C.1.1
N$14
  Top 0.254: U.1.4 8.78,26.09 9.37,26.67 13.65,26.67 14.76,27.78 R.10.1 19.37,26.91 19.53,26.75 19.53,25.89 T.2.2
N$15
  Bottom 0.406: X.5.15 5.58,2.07 X.3.15
N$17
  Bottom 0.406: X.5.23 27.66,2.06 X.3.23
N$18
  Bottom 0.406: X.5.24 30.42,2.07 X.3.24
N$19
  Bottom 0.406: X.5.25 33.18,2.08 X.3.25
N$24  (via drill 0.3)
  Top 0.254: U.1.27 10.08,16.9 10.48,16.51 v10.79,16.51
  Bottom 0.254: v10.79,16.51 10.79,16.67 10,17.46 1.91,17.46 1.43,17.94 1.43,25.4 3.33,27.3 3.33,32.38 5.24,34.29 5.24,36.12 5.87,36.75 5.87,38.58 6.51,39.21 6.51,41.59 6.26,41.84 RJ45.11
N$25  (via drill 0.3)
  Top 0.254: U.1.26 9.43,16.44 v9.68,16.19 | v4.45,34.77 4.6,34.61 11.75,34.61 12.54,35.4 12.54,39.69 12.86,40.01 15.72,40.01 16.03,40.32 16.03,41.8 RJ45.9
  Bottom 0.254: v9.68,16.19 8.89,16.99 1.43,16.99 0.95,17.46 0.95,25.56 2.86,27.46 2.86,32.54 4.45,34.13 v4.45,34.77
N$26
  Bottom 0.254: R.6.2 13.49,41.8 RJ45.10
N$27
  Bottom 0.254: R.5.2 2.7,41.8 RJ45.12
N$28  (via drill 0.3)
  Top 0.254: U.2.17 33.25,31.1 33.02,30.88 30.72,30.88 v30,30.16
  Bottom 0.254: v30,30.16 C.10.2
N$29  (via drill 0.3)
  Top 0.254: RXD.K v25.24,39.05
  Bottom 0.254: v25.24,39.05 R.15.1
N$30  (via drill 0.3)
  Top 0.254: TXD.K v25.24,36.51
  Bottom 0.254: v25.24,36.51 R.14.1
N$31  (via drill 0.3)
  Top 0.254: U.3.30 20.09,11.18 20.64,10.64 23.26,10.64 v23.89,11.27 | v26.19,11.27 35,11.27 35.56,11.83 35.56,23.42 35.24,23.73 32.31,23.73 31.75,23.18 29.45,23.18 28.57,24.05 26.27,24.05 26.1,24.23 U.2.1
  Bottom 0.254: v23.89,11.27 v26.19,11.27
N$32  (via drill 0.3)
  Top 0.254: VCC.A 21.67,41.59 v21.35,41.27
  Bottom 0.254: v21.35,41.27 R.17.1
N$103
  Top 0.406: X.1.1 31.94,36.23 31.59,35.88 31.59,34.92 | 31.59,34.92 C.12.1 | FB.1.2 31.59,34.92
POUT  (via drill 0.3 pad 0.15)
  Top 0.254: U.3.9 21.69,19.47 v21.59,19.37
  Top 0.406: X.5.12 31.8,2.08 X.3.12
  Bottom 0.254: X.3.12 31.8,9.95 31.59,10.16 22.15,10.16 21.83,10.48 21.83,16.83 21.43,17.22 21.43,19.21 v21.59,19.37
SCK  (via drill 0.3)
  Top 0.254: U.1.8 6.18,23.66 6.67,23.18 9.84,23.18 10.79,22.3 v13.26,22.3 | U.3.17 15.14,19.79 v16.11,18.81 v18.49,18.81
  Bottom 0.254: X.4.3 31.75,14.21 31.43,13.89 28.65,13.89 27.86,14.68 24.29,14.68 23.89,15.08 23.89,20.32 23.1,21.11 19.37,21.11 19.05,20.8 19.05,19.37 v18.49,18.81 | v13.26,22.3 14.05,22.3 14.45,21.91 14.45,19.13 14.76,18.81 v16.11,18.81
SELECT  (via drill 0.3)
  Top 0.254: U.3.13 18.49,19.77 20.16,18.1 21.67,18.1 v22.07,18.49
  Top 0.406: X.5.13 34.56,2.09 X.3.13
  Bottom 0.254: X.3.13 34.56,10.21 34.13,10.64 22.62,10.64 22.3,10.95 22.3,17.38 22.07,17.62 v22.07,18.49
TXD1  (via drill 0.3)
  Top 0.254: U.3.31 20.89,11.41 21.19,11.11 22.7,11.11 23.1,11.51 v23.1,12.06 | v35.16,26.35 28.97,26.35 28.7,26.08 U.2.5
  Bottom 0.254: v35.16,26.35 35.56,25.96 35.56,11.83 35,11.27 27.62,11.27 26.83,12.06 v23.1,12.06
USB+  (via drill 0.3)
  Top 0.254: v34.53,31.11 34.55,31.13 U.2.15 34.55,33.36 34.77,33.58 35.16,33.58 35.4,33.81 35.4,38.58 35.08,38.89 34.05,38.89 33.58,39.37 30.96,39.37 30.64,39.05 X.1.3
  Bottom 0.254: v34.53,31.11 34.21,31.11 33.97,30.88 C.14.1
USB-  (via drill 0.3)
  Top 0.254: v32.54,30.16 33.66,30.16 33.9,30.4 U.2.16 33.9,33.02 33.58,33.34 33.58,38.58 33.26,38.89 31.51,38.89 31.29,38.67 X.1.2
  Bottom 0.254: v32.54,30.16 C.15.1

### Text on the board
Top: PLIPBOX | PICO | V1.0 | TOP
Bottom: BOTTOM | V1.0 | PLIPBOX PICO
tPlace: VCC | RXD | TXD | FT232RL | ENC28J60 | 1 | ATMega328P | JTAG | PLIPBOX PICO | V1.0
bPlace: 2020 | V1.0 | PLIPBOX PICO | ENGINEERED BY LALLAFA | RE DESIGN BY FIRNHABER | INSPIRED BY CLAUS71 | !RST | CK | SO | www.A1K.org | GND | SI | 5V